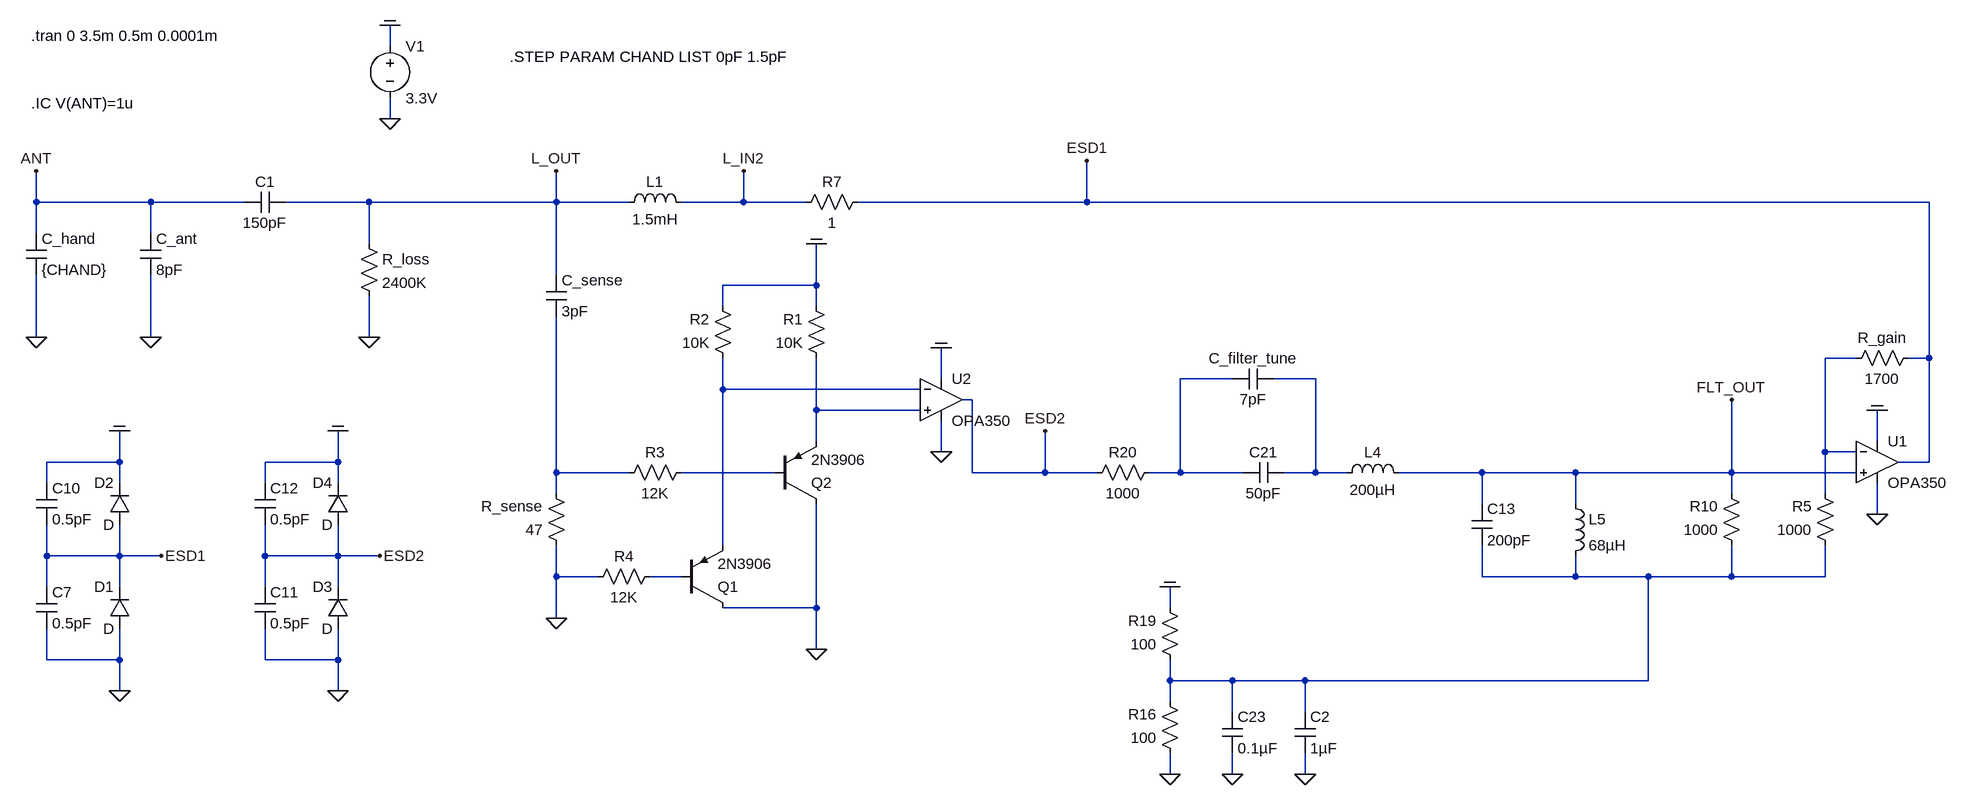
[diagram p0: schematic 2020_current_sense_sin_drive_osc_v04.asc]
2020_current_sense_sin_drive_osc_v04.asc, the LTspice schematic file:
Version 4
SHEET 1 3920 3076
WIRE -48 256 -48 224
WIRE -48 368 -48 336
WIRE -592 496 -592 448
WIRE -416 496 -592 496
WIRE -272 496 -416 496
WIRE -80 496 -208 496
WIRE 208 496 208 448
WIRE 208 496 -80 496
WIRE 320 496 208 496
WIRE 496 496 496 448
WIRE 496 496 400 496
WIRE 592 496 496 496
WIRE 1024 496 1024 432
WIRE 1024 496 672 496
WIRE 2320 496 1024 496
WIRE -592 544 -592 496
WIRE -416 544 -416 496
WIRE -80 560 -80 496
WIRE 208 608 208 496
WIRE 608 624 608 560
WIRE 608 624 464 624
WIRE 464 656 464 624
WIRE 608 656 608 624
WIRE -592 704 -592 608
WIRE -416 704 -416 608
WIRE -80 704 -80 640
WIRE 2208 736 2160 736
WIRE 2320 736 2320 496
WIRE 2320 736 2288 736
WIRE 800 768 800 720
WIRE 1248 768 1168 768
WIRE 1376 768 1312 768
WIRE 464 784 464 736
WIRE 768 784 464 784
WIRE 848 800 832 800
WIRE 608 816 608 736
WIRE 768 816 608 816
WIRE 608 864 608 816
WIRE 2240 864 2240 816
WIRE 800 880 800 832
WIRE 2160 880 2160 736
WIRE 2208 880 2160 880
WIRE -464 896 -464 848
WIRE -464 896 -576 896
WIRE -128 896 -128 848
WIRE -128 896 -240 896
WIRE 2320 896 2320 736
WIRE 2320 896 2272 896
WIRE 208 912 208 672
WIRE 320 912 208 912
WIRE 544 912 400 912
WIRE 848 912 848 800
WIRE 960 912 960 848
WIRE 960 912 848 912
WIRE 1040 912 960 912
WIRE 1168 912 1168 768
WIRE 1168 912 1120 912
WIRE 1264 912 1168 912
WIRE 1376 912 1376 768
WIRE 1376 912 1328 912
WIRE 1424 912 1376 912
WIRE 1632 912 1504 912
WIRE 1776 912 1632 912
WIRE 2016 912 2016 800
WIRE 2016 912 1776 912
WIRE 2208 912 2016 912
WIRE -576 928 -576 896
WIRE -464 928 -464 896
WIRE -240 928 -240 896
WIRE -128 928 -128 896
WIRE 208 944 208 912
WIRE 2016 944 2016 912
WIRE 2160 944 2160 880
WIRE 1632 960 1632 912
WIRE 1776 960 1776 912
WIRE 2240 976 2240 928
WIRE 464 1024 464 784
WIRE -576 1040 -576 992
WIRE -464 1040 -464 992
WIRE -464 1040 -576 1040
WIRE -400 1040 -464 1040
WIRE -240 1040 -240 992
WIRE -128 1040 -128 992
WIRE -128 1040 -240 1040
WIRE -64 1040 -128 1040
WIRE 208 1072 208 1024
WIRE 272 1072 208 1072
WIRE 400 1072 352 1072
WIRE 1632 1072 1632 1024
WIRE 1776 1072 1776 1040
WIRE 1776 1072 1632 1072
WIRE 1888 1072 1776 1072
WIRE 2016 1072 2016 1024
WIRE 2016 1072 1888 1072
WIRE 2160 1072 2160 1024
WIRE 2160 1072 2016 1072
WIRE -576 1088 -576 1040
WIRE -464 1088 -464 1040
WIRE -240 1088 -240 1040
WIRE -128 1088 -128 1040
WIRE 608 1120 608 960
WIRE 608 1120 464 1120
WIRE 1152 1120 1152 1088
WIRE 208 1136 208 1072
WIRE 608 1184 608 1120
WIRE -576 1200 -576 1152
WIRE -464 1200 -464 1152
WIRE -464 1200 -576 1200
WIRE -240 1200 -240 1152
WIRE -128 1200 -128 1152
WIRE -128 1200 -240 1200
WIRE 1152 1232 1152 1200
WIRE 1248 1232 1152 1232
WIRE 1360 1232 1248 1232
WIRE 1888 1232 1888 1072
WIRE 1888 1232 1360 1232
WIRE -464 1248 -464 1200
WIRE -128 1248 -128 1200
WIRE 1152 1264 1152 1232
WIRE 1248 1280 1248 1232
WIRE 1360 1280 1360 1232
WIRE 1152 1376 1152 1344
WIRE 1248 1376 1248 1344
WIRE 1360 1376 1360 1344
FLAG -48 368 0
FLAG -48 224 COM
FLAG -464 1248 0
FLAG -464 848 COM
FLAG -400 1040 ESD1
FLAG -128 1248 0
FLAG -128 848 COM
FLAG -64 1040 ESD2
FLAG -592 448 ANT
FLAG -592 704 0
FLAG -416 704 0
FLAG -80 704 0
FLAG 496 448 L_IN2
FLAG 208 448 L_OUT
FLAG 2016 800 FLT_OUT
FLAG 1024 432 ESD1
FLAG 1152 1376 0
FLAG 1152 1088 COM
FLAG 1248 1376 0
FLAG 2240 816 COM
FLAG 2240 976 0
FLAG 608 1184 0
FLAG 208 1136 0
FLAG 960 848 ESD2
FLAG 1360 1376 0
FLAG 608 560 COM
FLAG 800 720 COM
FLAG 800 880 0
SYMBOL voltage -48 240 R0
WINDOW 123 0 0 Left 0
WINDOW 39 0 0 Left 0
SYMATTR InstName V1
SYMATTR Value 3.3V
SYMBOL diode -448 1152 R180
WINDOW 0 24 64 Left 2
WINDOW 3 24 0 Left 2
SYMATTR InstName D1
SYMBOL diode -448 992 R180
WINDOW 0 24 64 Left 2
WINDOW 3 24 0 Left 2
SYMATTR InstName D2
SYMBOL cap -592 1088 R0
SYMATTR InstName C7
SYMATTR Value 0.5pF
SYMBOL cap -592 928 R0
SYMATTR InstName C10
SYMATTR Value 0.5pF
SYMBOL diode -112 1152 R180
WINDOW 0 24 64 Left 2
WINDOW 3 24 0 Left 2
SYMATTR InstName D3
SYMBOL diode -112 992 R180
WINDOW 0 24 64 Left 2
WINDOW 3 24 0 Left 2
SYMATTR InstName D4
SYMBOL cap -256 1088 R0
SYMATTR InstName C11
SYMATTR Value 0.5pF
SYMBOL cap -256 928 R0
SYMATTR InstName C12
SYMATTR Value 0.5pF
SYMBOL ind 304 512 R270
WINDOW 0 32 56 VTop 2
WINDOW 3 5 56 VBottom 2
SYMATTR InstName L1
SYMATTR Value 1.5mH
SYMATTR SpiceLine Rser=52 Rpar=20Meg
SYMBOL cap -432 544 R0
SYMATTR InstName C_ant
SYMATTR Value 8pF
SYMBOL cap -608 544 R0
SYMATTR InstName C_hand
SYMATTR Value {CHAND}
SYMBOL res -96 544 R0
SYMATTR InstName R_loss
SYMATTR Value 2400K
SYMBOL res 688 480 R90
WINDOW 0 0 56 VBottom 2
WINDOW 3 32 56 VTop 2
SYMATTR InstName R7
SYMATTR Value 1
SYMBOL cap 192 608 R0
SYMATTR InstName C_sense
SYMATTR Value 3pF
SYMBOL res 224 1040 R180
WINDOW 0 36 76 Left 2
WINDOW 3 36 40 Left 2
SYMATTR InstName R_sense
SYMATTR Value 47
SYMBOL cap 1328 896 R90
WINDOW 0 0 32 VBottom 2
WINDOW 3 32 32 VTop 2
SYMATTR InstName C21
SYMATTR Value 50pF
SYMBOL ind 1408 928 R270
WINDOW 0 32 56 VTop 2
WINDOW 3 5 56 VBottom 2
SYMATTR InstName L4
SYMATTR Value 200µH
SYMATTR SpiceLine Rser=6
SYMBOL res 2032 1040 R180
WINDOW 0 36 76 Left 2
WINDOW 3 36 40 Left 2
SYMATTR InstName R10
SYMATTR Value 1000
SYMBOL cap 1616 960 R0
SYMATTR InstName C13
SYMATTR Value 200pF
SYMBOL ind 1760 944 R0
SYMATTR InstName L5
SYMATTR Value 68µH
SYMATTR SpiceLine Rser=2
SYMBOL res 1168 1360 R180
WINDOW 0 36 76 Left 2
WINDOW 3 36 40 Left 2
SYMATTR InstName R16
SYMATTR Value 100
SYMBOL res 1168 1216 R180
WINDOW 0 36 76 Left 2
WINDOW 3 36 40 Left 2
SYMATTR InstName R19
SYMATTR Value 100
SYMBOL cap 1232 1280 R0
SYMATTR InstName C23
SYMATTR Value 0.1µF
SYMBOL res 1136 896 R90
WINDOW 0 0 56 VBottom 2
WINDOW 3 32 56 VTop 2
SYMATTR InstName R20
SYMATTR Value 1000
SYMBOL res 2192 752 R270
WINDOW 0 32 56 VTop 2
WINDOW 3 0 56 VBottom 2
SYMATTR InstName R_gain
SYMATTR Value 1700
SYMBOL res 2176 1040 R180
WINDOW 0 36 76 Left 2
WINDOW 3 36 40 Left 2
SYMATTR InstName R5
SYMATTR Value 1000
SYMBOL SBORKA\\OPamp\\OPA350 2240 896 R0
SYMATTR InstName U1
SYMBOL cap -208 480 R90
WINDOW 0 0 32 VBottom 2
WINDOW 3 32 32 VTop 2
SYMATTR InstName C1
SYMATTR Value 150pF
SYMBOL cap 1344 1280 R0
SYMATTR InstName C2
SYMATTR Value 1µF
SYMBOL cap 1312 752 R90
WINDOW 0 0 32 VBottom 2
WINDOW 3 32 32 VTop 2
SYMATTR InstName C_filter_tune
SYMATTR Value 7pF
SYMBOL pnp 400 1120 M180
SYMATTR InstName Q1
SYMATTR Value 2N3906
SYMBOL pnp 544 960 M180
SYMATTR InstName Q2
SYMATTR Value 2N3906
SYMBOL res 624 752 R180
WINDOW 0 36 76 Left 2
WINDOW 3 36 40 Left 2
SYMATTR InstName R1
SYMATTR Value 10K
SYMBOL res 480 752 R180
WINDOW 0 36 76 Left 2
WINDOW 3 36 40 Left 2
SYMATTR InstName R2
SYMATTR Value 10K
SYMBOL SBORKA\\OPamp\\OPA350 800 800 R0
SYMATTR InstName U2
SYMBOL res 416 896 R90
WINDOW 0 0 56 VBottom 2
WINDOW 3 32 56 VTop 2
SYMATTR InstName R3
SYMATTR Value 12K
SYMBOL res 368 1056 R90
WINDOW 0 0 56 VBottom 2
WINDOW 3 32 56 VTop 2
SYMATTR InstName R4
SYMATTR Value 12K
TEXT -600 240 Left 2 !.tran 0 3.5m 0.5m 0.0001m
TEXT -600 344 Left 2 !.IC V(ANT)=1u
TEXT 136 272 Left 2 !.STEP PARAM CHAND LIST 0pF 1.5pF

The netlist it stands for:
* 2020_current_sense_sin_drive_osc_v04.asc
V1 COM 0 3.3V
D1 0 ESD1 D
D2 ESD1 COM D
C7 ESD1 0 0.5pF
C10 COM ESD1 0.5pF
D3 0 ESD2 D
D4 ESD2 COM D
C11 ESD2 0 0.5pF
C12 COM ESD2 0.5pF
L1 L_OUT L_IN2 1.5mH Rser=52 Rpar=20Meg
C_ant ANT 0 8pF
C_hand ANT 0 {CHAND}
R_loss L_OUT 0 2400K
R7 ESD1 L_IN2 1
C_sense L_OUT N006 3pF
R_sense 0 N006 47
C21 N003 N002 50pF
L4 N003 FLT_OUT 200µH Rser=6
R10 N009 FLT_OUT 1000
C13 FLT_OUT N009 200pF
L5 FLT_OUT N009 68µH Rser=2
R16 0 N009 100
R19 N009 COM 100
C23 N009 0 0.1µF
R20 N002 ESD2 1000
R_gain N001 ESD1 1700
R5 N009 N001 1000
* U1: OPA350 (symbol SBORKA\OPamp\OPA350 not available, pins judged from their places): In+=FLT_OUT In-=N001 V+=COM V-=0 OUT=ESD1
C1 L_OUT ANT 150pF
C2 N009 0 1µF
C_filter_tune N003 N002 7pF
Q1 0 N008 N004 0 2N3906
Q2 0 N007 N005 0 2N3906
R1 N005 COM 10K
R2 N004 COM 10K
* U2: OPA350 (symbol SBORKA\OPamp\OPA350 not available, pins judged from their places): In+=N005 In-=N004 V+=COM V-=0 OUT=ESD2
R3 N007 N006 12K
R4 N008 0 12K
.model D D
.lib standard.dio
.model NPN NPN
.model PNP PNP
.lib standard.bjt
.tran 0 3.5m 0.5m 0.0001m
.IC V(ANT)=1u
.STEP PARAM CHAND LIST 0pF 1.5pF
.backanno
.end